# EAGLE board vldp-hw-rev03 (EAGLE 6.6.0)
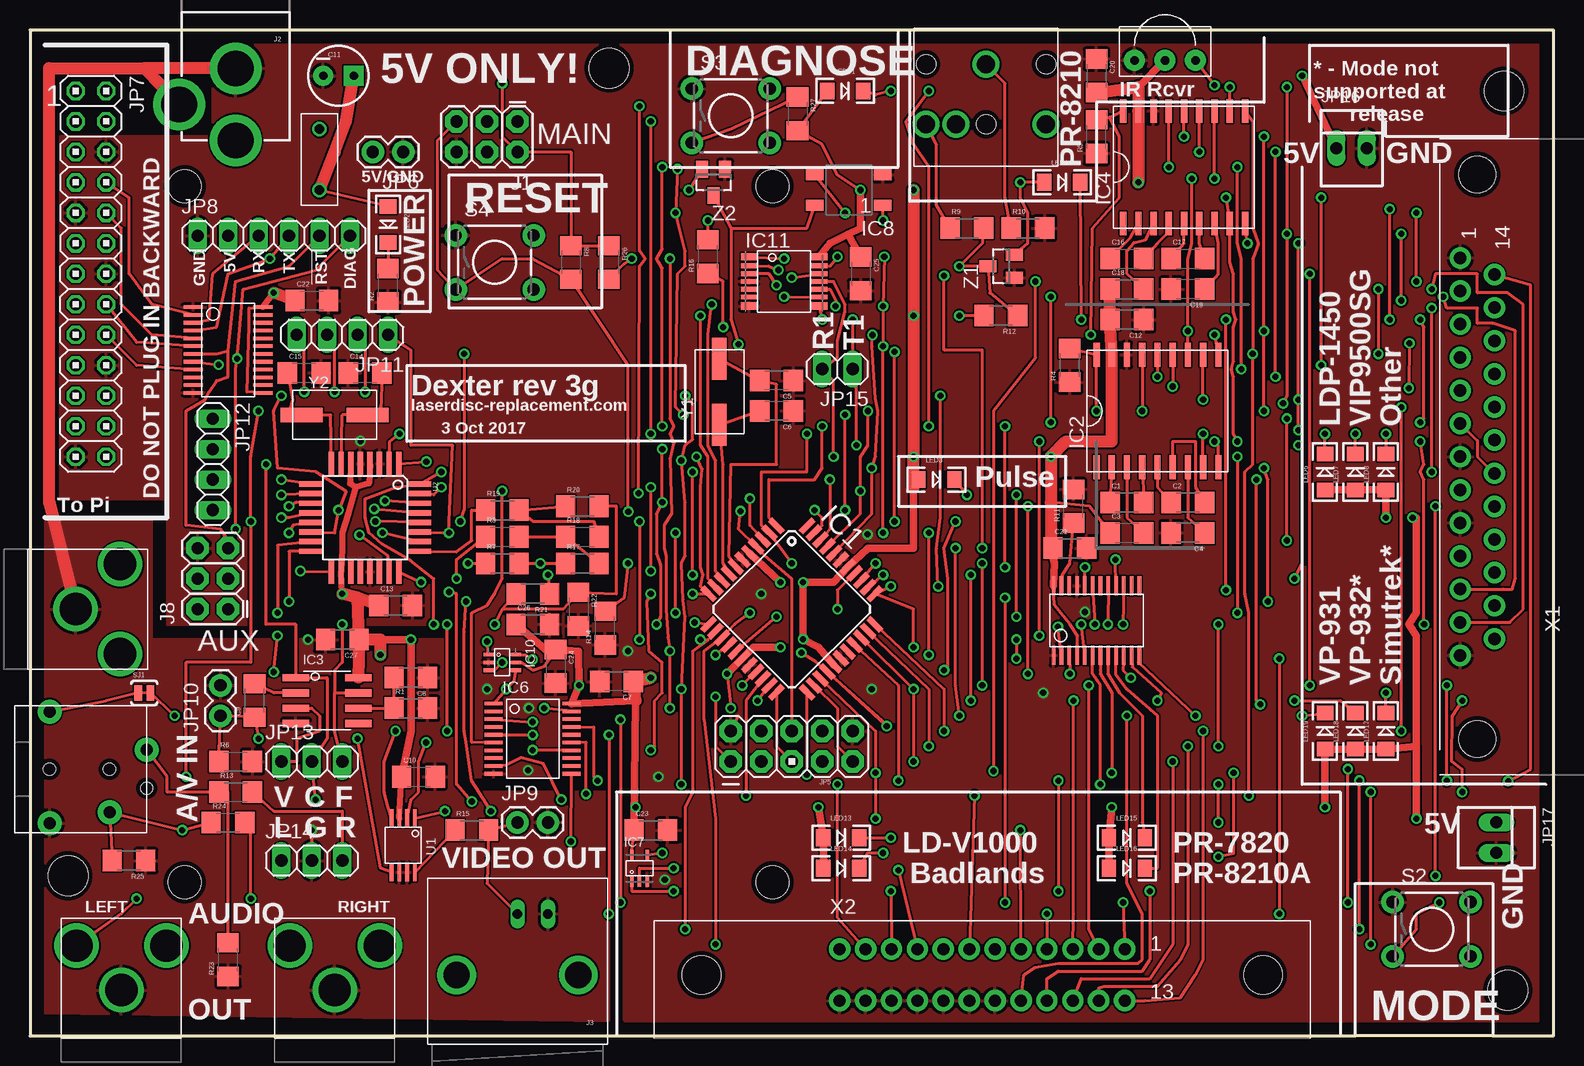
[diagram p3: board, top side]
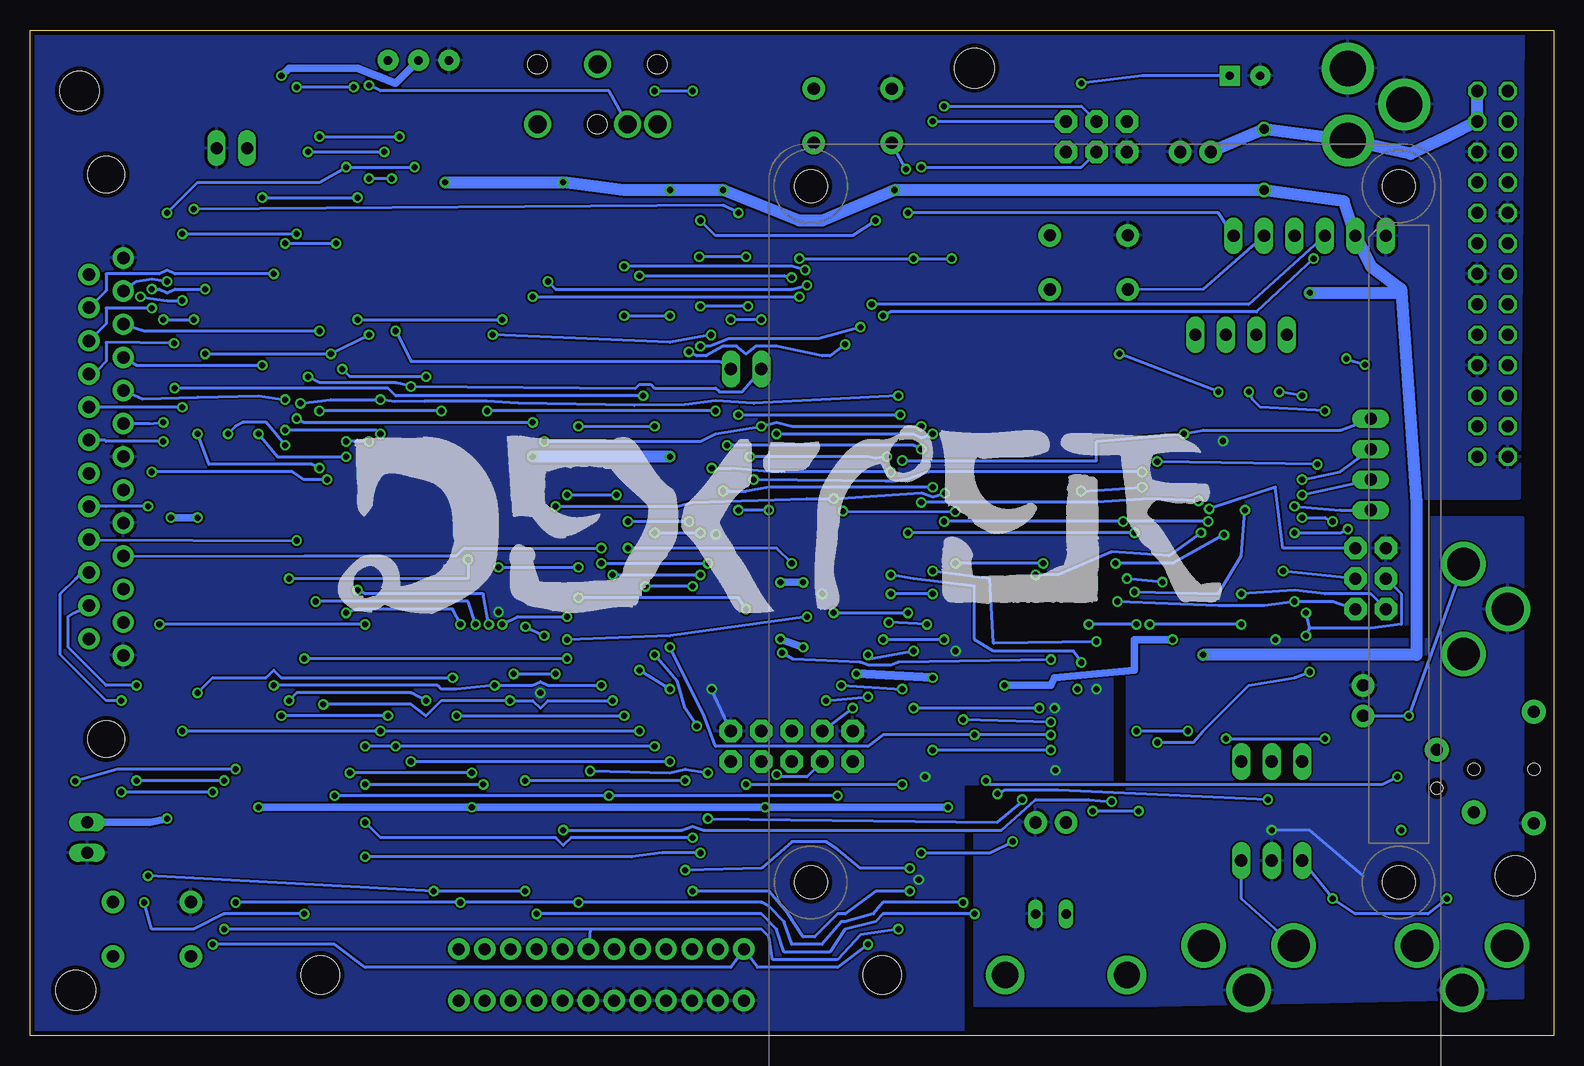
[diagram p4: board, bottom side, seen from below]

Size 127 x 83.82 mm. Coordinates in mm from the lower left corner, seen from the top.
Outline: 0,0 127,0 127,83.82 0,83.82 0,0
Copper layers (1*16): Top 0.0356mm / dielectric 1.5011mm / Bottom 0.0356mm
Design rules "OSHParkLaenPCBOrder": minimum track width 6mil, minimum drill 13mil, track to track 6mil, track to pad 6mil, pad to pad 6mil, via to via 6mil, smd to smd 6mil, copper to edge 15mil, drill to drill 6mil, minimum pad ring 7mil, minimum via ring 7mil, stop-mask expansion 3mil, vias tented up to drill 0mil, thermal gap 10mil

## Footprints (pad centres in the part's own frame; a part is rotated, then mirrored left to right if it is on the bottom)
RCA-SWITCHCRAFT-4X = drill 2.69: P1 0,0; P2 -3.75,3.7; P3 3.75,3.7
1206 = smd 1.6 x 1.8: 1 -1.4,0; 2 1.4,0
CPOL-RADIAL-10UF-25V = drill 0.7 pad 1.651 square: 1 1.27,0 | drill 0.7 pad 1.651: 2 -1.27,0
PTC = drill 0.8: P$1 -2.54,0; P$2 2.54,0
TQFP44 = smd 1.5 x 0.5: 1 -5.8,4; 2 -5.8,3.2; 3 -5.8,2.4; 4 -5.8,1.6; 5 -5.8,0.8; 6 -5.8,0; 7 -5.8,-0.8; 8 -5.8,-1.6; 9 -5.8,-2.4; 10 -5.8,-3.2; 11 -5.8,-4; 23 5.8,-4; 24 5.8,-3.2; 25 5.8,-2.4; 26 5.8,-1.6; 27 5.8,-0.8; 28 5.8,0; 29 5.8,0.8; 30 5.8,1.6; 31 5.8,2.4; 32 5.8,3.2; 33 5.8,4 | smd 0.5 x 1.5: 12 -4,-5.8; 13 -3.2,-5.8; 14 -2.4,-5.8; 15 -1.6,-5.8; 16 -0.8,-5.8; 17 0,-5.8; 18 0.8,-5.8; 19 1.6,-5.8; 20 2.4,-5.8; 21 3.2,-5.8; 22 4,-5.8; 34 4,5.8; 35 3.2,5.8; 36 2.4,5.8; 37 1.6,5.8; 38 0.8,5.8; 39 0,5.8; 40 -0.8,5.8; 41 -1.6,5.8; 42 -2.4,5.8; 43 -3.2,5.8; 44 -4,5.8
SO18 = smd 0.533 x 1.981: 1 -5.08,-4.686; 2 -3.81,-4.686; 3 -2.54,-4.686; 4 -1.27,-4.686; 5 0,-4.686; 6 1.27,-4.686; 7 2.54,-4.686; 8 3.81,-4.686; 9 5.08,-4.686; 10 5.08,4.686; 11 3.81,4.686; 12 2.54,4.686; 13 1.27,4.686; 14 0,4.686; 15 -1.27,4.686; 16 -2.54,4.686; 17 -3.81,4.686; 18 -5.08,4.686
LM1881M = smd 0.6 x 2.2: P1 -1.905,-2.6; P2 -0.635,-2.6; P3 0.635,-2.6; P4 1.905,-2.6; P5 1.905,2.6; P6 0.635,2.6; P7 -0.635,2.6; P8 -1.905,2.6
TSSOP24 = smd 0.3 x 1.6: 1 -3.575,-2.9; 2 -2.925,-2.9; 3 -2.275,-2.9; 4 -1.625,-2.9; 5 -0.975,-2.9; 6 -0.325,-2.9; 7 0.325,-2.9; 8 0.975,-2.9; 9 1.625,-2.9; 10 2.275,-2.9; 11 2.925,-2.9; 12 3.575,-2.9; 13 3.575,2.9; 14 2.925,2.9; 15 2.275,2.9; 16 1.625,2.9; 17 0.975,2.9; 18 0.325,2.9; 19 -0.325,2.9; 20 -0.975,2.9; 21 -1.625,2.9; 22 -2.275,2.9; 23 -2.925,2.9; 24 -3.575,2.9
TSSOP20-MPO = smd 0.3 x 1.5: 1 -2.925,-3.25; 2 -2.275,-3.25; 3 -1.625,-3.25; 4 -0.975,-3.25; 5 -0.325,-3.25; 6 0.325,-3.25; 7 0.975,-3.25; 8 1.625,-3.25; 9 2.275,-3.25; 10 2.925,-3.25; 11 2.925,3.25; 12 2.275,3.25; 13 1.625,3.25; 14 0.975,3.25; 15 0.325,3.25; 16 -0.325,3.25; 17 -0.975,3.25; 18 -1.625,3.25; 19 -2.275,3.25; 20 -2.925,3.25
TSSOP5 = smd 0.3 x 0.85: P$1 -0.65,-1.125; P$2 0,-1.125; P$3 0.65,-1.125; P$4 0.65,1.125; P$5 -0.65,1.125
CPC1008N = smd 0.889 x 1.448: 1 -1.27,-2.832; 2 1.27,-2.832; 3 1.27,2.832; 4 -1.27,2.832
TSSOP6-DCK = smd 0.3 x 0.85: P$1 -0.65,-1.125; P$2 0,-1.125; P$3 0.65,-1.125; P$4 0.65,1.125; P$5 0,1.125; P$6 -0.65,1.125
TSSOP14-MPO = smd 0.6 x 1.35: 1 -2.05,-2.925; 7 2.05,-2.925; 8 2.05,2.925; 14 -2.05,2.925 | smd 0.4 x 1.35: 2 -1.3,-2.925; 3 -0.65,-2.925; 4 0,-2.925; 5 0.65,-2.926; 6 1.3,-2.925; 9 1.3,2.925; 10 0.65,2.925; 11 0,2.925; 12 -0.65,2.925; 13 -1.3,2.925
VISHAY = drill 0.7 pad 1.75: 1 -2.54,0; 2 0,0; 3 2.54,0
2X3 = drill 1.016 pad 1.88 octagon: 1 0,0; 2 0,2.54; 3 2.54,0; 4 2.54,2.54; 5 5.08,0; 6 5.08,2.54
POWER_JACK_PTH = drill 2.997 pad 4.318: GND 0,7.7; GNDBREAK 4.7,10.7; PWR 0,13.7
BNC = drill 2.2: 3 -5.08,5.08; 4 5.08,5.08 | drill 0.8 long: GND -2.54,0; S 0,0
3.5MM-SJ-43514 = drill 1 pad 2: 1 2.9,4.8; 2 7.9,-3.6; 3 11,1.6; 4 2.9,-4.5 | hole 1: 7.9,0; 2.9,0; 11,-1.6
3.5MM-SJ1-3554NG = drill 1.5: 1 0,0; 2 5,-5; 3 5,5; 4 5,-2.5 | hole 1.6: 0,5; 0,-5; 5,0
STAND-OFF = hole 3.302: 0,0
AVR_ICSP = drill 1.016 pad 1.88 octagon: 1 -1.27,5.08; 2 1.27,5.08; 3 -1.27,2.54; 4 1.27,2.54; 5 -1.27,0; 6 1.27,0; 7 -1.27,-2.54; 8 1.27,-2.54; 9 -1.27,-5.08; 10 1.27,-5.08
1X02 = drill 1.016 pad 1.88: 1 0,0; 2 2.54,0
2X13 = drill 1.016 octagon: 1 -15.24,-1.27; 2 -15.24,1.27; 3 -12.7,-1.27; 4 -12.7,1.27; 5 -10.16,-1.27; 6 -10.16,1.27; 7 -7.62,-1.27; 8 -7.62,1.27; 9 -5.08,-1.27; 10 -5.08,1.27; 11 -2.54,-1.27; 12 -2.54,1.27; 13 0,-1.27; 14 0,1.27; 15 2.54,-1.27; 16 2.54,1.27; 17 5.08,-1.27; 18 5.08,1.27; 19 7.62,-1.27; 20 7.62,1.27; 21 10.16,-1.27; 22 10.16,1.27; 23 12.7,-1.27; 24 12.7,1.27; 25 15.24,-1.27; 26 15.24,1.27
1X06 = drill 1.016 long: 1 -6.35,0; 2 -3.81,0; 3 -1.27,0; 4 1.27,0; 5 3.81,0; 6 6.35,0
1X04 = drill 1.016 long: 1 -3.81,0; 2 -1.27,0; 3 1.27,0; 4 3.81,0
1X03 = drill 1.016 long: 1 -2.54,0; 2 0,0; 3 2.54,0
1X02' = drill 1.016 long: 1 -1.27,0; 2 1.27,0
22-23-2021 = drill 1 long: 1 -1.27,0; 2 1.27,0
LED-1206 = smd 1.2 x 1.4: A -1.5,0; C 1.5,0
TACTILE-PTH = drill 1.016 pad 1.88: 1 -3.251,2.261; 2 3.251,2.261; 3 -3.251,-2.261; 4 3.251,-2.261
SJ_2S-TRACE = smd 0.635 x 1.27: 1 -0.508,0; 2 0.508,0
MAXIM-UMAX-LONGPADS = smd 0.305 x 1.5: 1 -0.975,-2.25; 2 -0.325,-2.25; 3 0.325,-2.25; 4 0.975,-2.25; 5 0.975,2.25; 6 0.325,2.25; 7 -0.325,2.25; 8 -0.975,2.25
TQFP32-LONGPADS = smd 2 x 0.45: 1 -4.5,2.8; 2 -4.5,2; 3 -4.5,1.2; 4 -4.5,0.4; 5 -4.5,-0.4; 6 -4.5,-1.2; 7 -4.5,-2; 8 -4.5,-2.8; 17 4.5,-2.8; 18 4.5,-2; 19 4.5,-1.2; 20 4.5,-0.4; 21 4.5,0.4; 22 4.5,1.2; 23 4.5,2; 24 4.5,2.8 | smd 0.45 x 2: 9 -2.8,-4.5; 10 -2,-4.5; 11 -1.2,-4.5; 12 -0.4,-4.5; 13 0.4,-4.5; 14 1.2,-4.5; 15 2,-4.5; 16 2.8,-4.5; 25 2.8,4.5; 26 2,4.5; 27 1.2,4.5; 28 0.4,4.5; 29 -0.4,4.5; 30 -1.2,4.5; 31 -2,4.5; 32 -2.8,4.5
RPI2 = hole 2.75: 3.5,3.5; 61.5,3.5; 3.5,52.5; 61.5,52.5
A32077-ND = drill 1.041 pad 1.778: P1 -16.561,-1.422; P2 -13.801,-1.422; P3 -11.04,-1.422; P4 -8.28,-1.422; P5 -5.52,-1.422; P6 -2.76,-1.422; P7 0,-1.422; P8 2.76,-1.422; P9 5.52,-1.422; P10 8.28,-1.422; P11 11.04,-1.422; P12 13.801,-1.422; P13 16.561,-1.422; P14 -15.182,1.422; P15 -12.417,1.422; P16 -9.658,1.422; P17 -6.898,1.422; P18 -4.139,1.422; P19 -1.38,1.422; P20 1.38,1.422; P21 4.139,1.422; P22 6.898,1.422; P23 9.658,1.422; P24 12.417,1.422; P25 15.171,1.422 | hole 3.048: -23.52,0; 23.52,0
112-YYY-213R001 = drill 1 pad 1.778: 1 11.88,2.145; 2 9.72,2.145; 3 7.56,2.145; 4 5.4,2.145; 5 3.24,2.145; 6 1.08,2.145; 7 -1.08,2.145; 8 -3.24,2.145; 9 -5.4,2.145; 10 -7.56,2.145; 11 -9.72,2.145; 12 -11.88,2.145; 13 11.88,-2.145; 14 9.72,-2.145; 15 7.56,-2.145; 16 5.4,-2.145; 17 3.24,-2.145; 18 1.08,-2.145; 19 -1.08,-2.145; 20 -3.24,-2.145; 21 -5.4,-2.145; 22 -7.56,-2.145; 23 -9.72,-2.145; 24 -11.88,-2.145 | hole 3.2: 23.4,0; -23.4,0
CRYSTAL-CSM-3X = smd 3.5 x 1.2: P$1 -2.75,0; P$2 2.75,0
SOT23 = smd 1 x 1.4: 1 -0.95,-1.1; 2 0.95,-1.1; 3 0,1.1

## Placement (x,y rotation side)
AUD_LEFT  RCA-SWITCHCRAFT  [RCA-SWITCHCRAFT-4X]  7.62,3.81 0 top
AUD_RIGHT  RCA-SWITCHCRAFT  [RCA-SWITCHCRAFT-4X]  25.4,3.81 0 top
C1  0.1uF  [1206]  91.44,44.45 0 top
C2  0.1uF  [1206]  96.52,44.45 0 top
C3  0.1uF  [1206]  91.44,41.91 0 top
C4  0.1uF  [1206]  96.52,41.91 180 top
C5  20pF  [1206]  62.23,54.61 180 top
C6  20pF  [1206]  62.23,52.07 180 top
C7  0.1uF  [1206]  48.9,29.53 180 top
C8  0.1uF  [1206]  31.75,29.84 180 top
C9  0.1uF  [1206]  18.73,27.94 90 top
C10  0.1uF  [1206]  32.38,21.59 0 top
C11  470uF/10V  [CPOL-RADIAL-10UF-25V]  25.72,80.01 0 top
C12  0.1uF  [1206]  91.44,59.69 180 top
C13  0.1uF  [1206]  30.48,35.88 0 top
C14  20pF  [1206]  27.94,55.24 0 top
C15  20pF  [1206]  22.86,55.24 0 top
C16  0.1uF  [1206]  91.44,64.77 0 top
C17  0.1uF  [1206]  96.52,64.77 0 top
C18  0.1uF  [1206]  91.44,62.23 0 top
C19  0.1uF  [1206]  96.52,62.23 180 top
C20  0.1uF  [1206]  88.9,80.01 270 top
C21  0.1uF  [1206]  86.68,40.64 0 top
C22  0.1uF  [1206]  23.5,61.28 0 top
C23  0.1uF  [1206]  51.75,17.14 0 top
C24  0.1uF  [1206]  43.81,30.8 270 top
C25  0.1uF  [1206]  69.25,63.5 270 top
C26  0.1uF  [1206]  41.91,34.29 0 top
C27  0.1uF  [1206]  26.04,33.02 180 top
F1  250mA PTC  [PTC]  24.13,73.03 270 top
IC1  ATMEGA644-MPO  [TQFP44]  63.5,35.56 315 top
IC2  MAX222CWN  [SO18]  93.98,52.07 0 top
IC3  LM1881-MPO  [LM1881M]  24.77,27.94 270 top
IC4  MAX222CWN  [SO18]  96.2,72.39 0 top
IC5  STP16CP05  [TSSOP24]  88.9,34.61 0 top
IC6  SN74LS244  [TSSOP20-MPO]  41.91,24.77 270 top
IC7  PR8210A_RMT  [TSSOP5]  50.8,13.97 0 top
IC8  CPC1008N  [CPC1008N]  68.26,70.48 90 top
IC9  SN74CBTD3384  [TSSOP24]  16.51,57.15 270 top
IC10  OR_GATE_3INPUT  [TSSOP6-DCK]  39.37,31.11 270 top
IC11  74HCT126  [TSSOP14-MPO]  62.87,62.87 270 top
IR1  TSOP2438  [VISHAY]  94.61,81.28 180 top
J1  AVR_SPI_PRG_6PTH  [2X3]  40.64,76.2 180 top
J2  IN-5V  [POWER_JACK_PTH]  17.14,88.31 180 top
J3  BNCPTH  [BNC]  40.64,10.16 180 top
J4  AV  [3.5MM-SJ-43514]  -1.27,22.23 0 top
J5  PR8210  [3.5MM-SJ1-3554NG]  79.69,80.96 270 top
J8  AVR_SPI_PRG_6PTH  [2X3]  16.51,35.56 90 top
JP1  STAND-OFF  [STAND-OFF]  123.19,3.81 0 bottom
JP2  STAND-OFF  [STAND-OFF]  3.17,13.34 0 top
JP3  STAND-OFF  [STAND-OFF]  122.87,78.74 0 top
JP4  STAND-OFF  [STAND-OFF]  48.26,80.64 0 top
JP5  JTAG  [AVR_ICSP]  63.5,24.13 90 top
JP6  [1X02]  31.11,73.66 180 top
JP7  RPI_IO  [2X13]  5.08,63.5 270 top
JP8  [1X06]  20.32,66.67 0 top
JP9  [1X02]  40.64,17.78 0 top
JP10  [1X02]  15.88,26.67 90 top
JP11  [1X04]  26.04,58.42 180 top
JP12  [1X04]  15.24,47.62 270 top
JP13  [1X03]  23.5,22.86 0 top
JP14  [1X03]  23.5,14.61 0 top
JP15  [1X02']  67.31,55.56 180 top
JP16  22-23-2021  [22-23-2021]  110.17,73.98 0 top
JP17  22-23-2021  [22-23-2021]  122.24,16.51 270 top
LED2  [LED-1206]  29.84,67.63 270 top
LED3  [LED-1206]  75.56,46.35 0 top
LED6  [LED-1206]  107.95,46.99 90 top
LED7  [LED-1206]  110.49,46.99 90 top
LED8  [LED-1206]  113.03,46.99 90 top
LED10  [LED-1206]  86.04,71.12 0 top
LED11  [LED-1206]  67.94,78.74 0 top
LED13  [LED-1206]  67.63,16.51 0 top
LED14  [LED-1206]  67.63,13.97 0 top
LED15  [LED-1206]  91.44,16.51 0 top
LED16  [LED-1206]  91.44,13.97 0 top
LED17  [LED-1206]  113.03,25.4 90 top
LED18  [LED-1206]  110.49,25.4 90 top
LED19  [LED-1206]  107.95,25.4 90 top
R1  680k  [1206]  31.75,27.3 0 top
R2  330  [1206]  29.84,62.55 90 top
R3  1500  [1206]  39.37,41.59 0 top
R4  1k  [1206]  86.68,55.88 90 top
R5  1k  [1206]  88.9,74.93 90 top
R6  75  [1206]  17.14,22.86 0 top
R7  1500  [1206]  39.37,39.37 0 top
R8  4.7k  [1206]  45.09,64.45 270 top
R9  75  [1206]  78.11,67.31 0 top
R10  1k  [1206]  83.19,67.31 0 top
R11  1k  [1206]  87,44.13 90 top
R12  4.7k  [1206]  80.92,60.02 180 top
R13  1k  [1206]  17.14,20.32 0 top
R14  1500  [1206]  47.94,33.97 90 top
R15  75  [1206]  36.83,17.14 0 top
R16  1k  [1206]  56.52,64.93 90 top
R17  750  [1206]  46.04,39.37 0 top
R18  750  [1206]  46.04,41.59 0 top
R19  1500  [1206]  39.37,43.81 0 top
R20  750  [1206]  46.04,44.13 0 top
R21  1500  [1206]  41.91,36.83 180 top
R22  330  [1206]  45.72,35.56 270 top
R23  680k  [1206]  16.51,6.35 90 top
R24  1k  [1206]  16.51,17.78 0 top
R25  680k  [1206]  8.26,14.61 180 top
R26  4.7k  [1206]  48.26,64.45 270 top
R27  4.7k  [1206]  63.98,76.83 270 top
S2  MODE  [TACTILE-PTH]  116.84,8.89 0 top
S3  DIAGNOSE  [TACTILE-PTH]  58.42,76.68 0 top
S4  RESET  [TACTILE-PTH]  38.73,64.45 0 top
SJ1  SOLDERJUMPERTRACE  [SJ_2S-TRACE]  9.53,28.57 0 top
U1  MAX4313  [MAXIM-UMAX-LONGPADS]  31.11,15.88 180 top
U2  ATMEGA328P  [TQFP32-LONGPADS]  27.94,43.18 270 top
U$1  RASPBERRY_PI2_LAYOUT  [RPI2]  65.41,74.3 270 bottom
U$2  [DEXTER_LOGO]  102.87,34.29 0 bottom
VID_IN  RCA-SWITCHCRAFT  [RCA-SWITCHCRAFT-4X]  3.81,35.56 270 top
X1  DB25-ALL  [A32077-ND]  120.65,48.26 270 top
X2  LD-V1000/PR-7820/PR-8210A  [112-YYY-213R001]  79.38,5.08 0 top
Y1  18.432MHz  [CRYSTAL-CSM-3X]  57.47,53.66 90 top
Y2  16 MHz  [CRYSTAL-CSM-3X]  25.4,51.75 0 top
Z1  BAT54S  [SOT23]  80.96,64.14 90 top
Z2  BAT54S  [SOT23]  56.99,71.12 180 top

## Tracks (layer width: path | path; a pad name or v marks a point on that pad's centre or on a via)
5V
  Bottom 1.016: JP6.2 F1.P$1 J2.PWR 11.91,73.5 8.89,74.93 JP7.4 JP7.2
!AUX_MOSI_SHDN  (via drill 0.51)
  Top 0.254: U1.2 31.75,19.68 32.38,20.32 32.38,22.86 v33.02,24.45 | 23.44,41.27 U2.15 20.64,40.86 v20.64,35.24 | v20.32,30.32 v20.64,33.34
  Bottom 0.254: J8.4 12.7,36.83 12.7,34.29 15.24,33.97 20.32,33.97 | 20.32,33.97 v20.64,35.24 | v33.02,24.45 30,24.45 29.21,25.4 25.4,29.21 21.59,29.84 v20.32,30.32 | v20.64,33.34 20.32,33.97
!AUX_VSYNC  (via drill 0.51)
  Top 0.254: U2.12 21.59,43.18 v20.95,43.18 | v19.05,52.07 18.41,48.26 v18.41,42.86 18.41,31.11 13.02,31.11 v13.02,21.59 | v25.4,53.66 25.4,57.15 JP11.3 | IC6.17 46.99,25.72 46.99,21.59 v47.31,21.27
  Bottom 0.254: v20.95,43.18 19.05,43.18 v18.41,42.86 | v19.05,52.07 24.45,52.39 25.08,53.02 v25.4,53.66 | v47.31,21.27 46.99,20.95 14.29,20.95 v13.02,21.59
!ENABLE_TX  (via drill 0.51)
  Top 0.254: IC10.P$4 40.32,29.53 v39.69,28.89 IC6.1
!PR8210_IR  (via drill 0.51)
  Top 0.254: v98.74,79.22 IR1.1
  Bottom 0.254: J5.4 78.74,78.74 97.79,78.74 v98.74,79.22
!PR8210_R_CTRL  (via drill 0.51)
  Top 0.254: IC11.2 61.59,64.14 v62.39,63.82 | R9.2 79.38,67.31 79.38,66.04 v77.47,64.14 Z1.3 80.01,61.91 R12.1
  Bottom 0.254: v62.39,63.82 63.5,64.14 v77.47,64.14
!PR8210A_CMB  (via drill 0.51)
  Top 0.254: IC7.P$4 v52.7,15.24 | v45.09,16.19 IC6.11
  Bottom 0.254: v52.7,15.24 46.99,15.24 v45.09,16.19
!PR8210A_ENABLE  (via drill 0.51)
  Top 0.254: IC6.19 v42.86,27.3 | v53.34,27.3 v53.34,32.07 53.18,33.18 53.02,35.56 53.02,40.01 52.86,40.64 52.86,42.55 53.5,43.5 53.34,48.1 53.66,49.37 53.34,50.16 53.66,50.8 53.34,51.44 v53.34,64.77 | v57.15,31.75 IC1.15 | IC11.1 v62.87,64.77 | v50.16,64.77 49.53,64.32 R26.2
  Bottom 0.254: v42.86,27.3 v53.34,27.3 | v53.34,32.07 56.83,31.43 v57.15,31.75 | v62.87,64.77 v53.34,64.77 v50.16,64.77
!PR8210A_R_CTRL  (via drill 0.51)
  Top 0.254: IC7.P$1 50.16,12.06 v53.66,12.06 | v71.75,12.06 X2.10
  Bottom 0.254: v53.66,12.06 56.52,12.06 59.05,10.16 59.69,10.16 61.59,8.26 62.55,8.26 63.82,10.16 65.41,12.06 v71.75,12.06
!RDEN  (via drill 0.51)
  Top 0.254: v79.38,40.64 79.38,57.15 76.2,57.15 v76.2,63.34 | v63.5,63.18 IC11.12
  Bottom 0.254: X1.P10 104.14,40.01 91.44,40.01 90.81,40.64 v79.38,40.64 | v76.2,63.34 64.14,63.34 v63.5,63.18
!REMOTE_CTRL  (via drill 0.51)
  Top 0.254: IC1.25 70.48,25.4 v70.48,21.91 v70.48,18.1 | v80.32,22.07 80.33,52.07 83.82,56.52 v83.82,62.87 | v44.29,19.68 42.8,22.67 40.96,23.18 39.69,22.54 IC6.9 | v62.23,62.55 61.59,63.5 IC11.3
  Bottom 0.254: v70.48,18.1 46.35,17.78 44.45,19.37 v44.29,19.68 | v80.32,22.07 73.66,21.91 72.39,22.23 v70.48,21.91 | v83.82,62.87 83.19,62.23 63.5,62.23 v62.23,62.55
!RST  (via drill 0.51)
  Top 0.254: R8.2 45.22,63.18 | v28.7,43.91 U2.29 | IC9.7 15.56,56.83 16.51,57.07 | 16.51,57.07 17.14,62.87 21.59,64.14 JP8.5 | J8.5 16.51,41.27 15.88,42.23 13.02,42.55 13.02,52.07 14.61,53.02 14.92,53.66 15.56,54.61 16.51,54.93 16.51,57.07 | J1.5 33.97,74.61 33.97,63.82 S4.3 39.37,64.77 41.91,64.77 R8.2 | JP5.6 63.5,38.1 61.28,40.01 IC1.4 59.05,42.23 v59.23,43.73 | v49.87,43.69 49.85,55.88 R8.2
  Bottom 0.254: J8.5 22.54,40.64 23.18,45.72 v28.7,43.91 | JP8.5 29.21,62.23 S4.3 | v59.23,43.73 v49.87,43.69
!RST3V3
  Top 0.254: IC9.6 8.89,57.78 JP7.16
!WREN  (via drill 0.51)
  Top 0.254: v104.78,41.27 v104.78,51.44 | v85.09,51.12 v85.09,61.59 | v62.87,61.59 IC11.9
  Bottom 0.254: X1.P22 v104.78,41.27 | v104.78,51.44 104.14,51.12 v85.09,51.12 | v85.09,61.59 v62.87,61.59
AUDIO_LEFT  (via drill 0.51)
  Top 0.254: AUD_LEFT.P2 7.62,10.16 v8.89,11.43 | v18.41,11.43 18.41,17.78 R24.2
  Bottom 0.254: v8.89,11.43 10.48,10.16 16.51,10.16 v18.41,11.43 JP14.1
AUDIO_RIGHT
  Top 0.254: R13.2 20.32,18.73 26.04,18.73 JP14.3
  Bottom 0.254: AUD_RIGHT.P2 26.04,11.43 JP14.3
AUX_D0  (via drill 0.51)
  Top 0.254: U2.23 29.84,40.01 v27.46,41.75 | v36.51,39.37 R7.1
  Bottom 0.254: v27.46,41.75 31.75,39.37 v36.51,39.37
AUX_D1  (via drill 0.51)
  Top 0.254: U2.24 v32.6,37.81 | v35.56,38.1 35.56,39.69 R3.1
  Bottom 0.254: v32.6,37.81 v35.56,38.1
AUX_D2
  Top 0.254: U2.25 35.56,40.32 36.83,41.27 36.83,43.81 R19.1
AUX_D3  (via drill 0.51)
  Top 0.254: U2.26 v29.38,41.92 | v43.18,38.42 R21.1
  Bottom 0.254: v29.38,41.92 32.07,40.01 36.83,40.32 41.27,38.42 v43.18,38.42
AUX_MISO_A0  (via drill 0.51)
  Top 0.254: v38.42,18.73 36.83,21.27 36.35,24.45 36.2,25.4 36.2,33.66 v36.35,36.2 | U2.16 21.59,40.38 v21.59,36.2 | U1.1 v34.59,18.73
  Bottom 0.254: v36.35,36.2 27.94,35.88 24.13,35.88 v21.59,36.2 18.41,36.2 J8.1 | v34.59,18.73 v38.42,18.73
AUX_PD5  (via drill 0.51)
  Top 0.254: U2.9 v20.95,46.35
  Bottom 0.254: v20.95,46.35 17.78,46.99 JP12.2
AUX_PD6  (via drill 0.51)
  Top 0.254: U2.10 v20.95,45.09
  Bottom 0.254: v20.95,45.09 JP12.3
AUX_PD7  (via drill 0.51)
  Top 0.254: U2.11 22.23,44.45 v21.59,44.13
  Bottom 0.254: v21.59,44.13 17.78,43.81 JP12.4
AUX_SCK  (via drill 0.51)
  Top 0.254: v22.54,38.73 U2.17
  Bottom 0.254: J8.3 v22.54,38.73
AUX_TX  (via drill 0.51)
  Top 0.254: IC6.6 36.83,24.45 36.83,35.24 38.1,35.88 38.73,36.83 39.37,38.1 v39.37,45.4 | v34.29,45.72 33.66,45.09 U2.31
  Bottom 0.254: v39.37,45.4 v34.29,45.72
CNT1_DB14  (via drill 0.51)
  Top 0.254: IC6.3 v41.91,26.15 | v49.21,26.35 v49.21,11.11 | v91.12,11.11 X2.1 | IC1.37 67.31,37.15 v67.31,35.56 | v81.28,36.51 v81.28,11.11 | v109.86,11.11 v109.86,22.23 | v123.22,21.23 125.09,22.23 125.09,62.55 X1.P14
  Bottom 0.254: v41.91,26.15 v49.21,26.35 | v49.21,11.11 55.88,11.11 56.67,10.16 59.05,9.53 59.37,9.53 60.96,7.62 63.5,7.62 64.14,9.53 65.41,10.79 66.04,11.11 v81.28,11.11 v91.12,11.11 v109.86,11.11 | v67.31,35.56 67.94,36.51 v81.28,36.51 | v109.86,22.23 119.7,22.23 v123.22,21.23
CNT2_DB15  (via drill 0.51)
  Top 0.254: X2.2 88.27,8.89 v88.27,29.21 | v79.38,29.21 v79.38,39.37 | v70.48,39.37 IC1.36 | v106.68,29.21 v106.68,63.5
  Bottom 0.254: X1.P15 120.65,62.1 120.65,63.5 116.2,63.5 115.57,63.82 114.94,63.5 v106.68,63.5 | v79.38,29.21 83.82,29.21 84.45,29.53 85.09,29.21 v88.27,29.21 91.44,28.89 92.71,28.89 93.03,29.21 v106.68,29.21 | v79.38,39.37 v70.48,39.37
CNT3_DB16  (via drill 0.51)
  Top 0.254: X2.3 87,10.16 v87,27.94 | v78.42,27.94 v78.42,38.42 | v71.12,38.42 IC1.35 | v102.55,27.62 102.23,27.94 v102.23,46.35 | v116.84,46.99 v116.84,60.64
  Bottom 0.254: v116.84,60.64 120.65,60.64 120.65,59.34 X1.P16 | v78.42,27.94 83.82,27.94 84.45,27.3 85.09,27.94 v87,27.94 92.71,27.94 93.98,26.67 95.25,27.62 v102.55,27.62 | v78.42,38.42 v71.12,38.42 | v102.23,46.35 104.14,46.35 105.09,46.99 v116.84,46.99
CNT4_DB17  (via drill 0.51)
  Top 0.254: 84.78,7.3 X2.4 v84.77,10.16 | IC6.5 v41.91,25.08 | v48.26,25.08 v48.26,10.16 | v73.66,32.38 73.66,35.56 IC1.34 v71.75,37.47 | v75.71,37.46 75.56,40.63 75.88,43.18 v75.88,53.34 | v114.99,57.72 v114.94,53.98
  Bottom 0.254: X1.P17 121.37,55.48 120.65,56.2 120.65,57.78 v114.99,57.72 | v41.91,25.08 v48.26,25.08 55.88,25.08 57.15,24.13 69.85,24.13 70.8,26.67 v73.66,32.38 | v48.26,10.16 55.88,10.16 56.52,9.53 59.05,8.89 60.33,6.99 64.14,6.99 64.77,8.89 66.04,10.16 v84.77,10.16 | v71.75,37.47 v75.71,37.46 | v75.88,53.34 96.52,53.34 97.16,53.98 v114.94,53.98
CNT6_DB24  (via drill 0.51)
  Top 0.254: U2.28 v28.79,42.86 | JP11.2 27.94,57.15 v27.94,53.66 | v36.2,56.83 36.2,43.81 v35.88,42.86 | v50.8,42.86 v50.8,33.02 | v55.88,33.02 56.52,33.02 | 56.52,33.02 IC1.13 | 56.52,33.02 55.24,32.07 55.24,20.32 54.61,19.05 v54.61,8.89 | v110.81,8.89 v110.81,21.27 | v118.11,21.27 v118.11,29.21
  Bottom 0.254: X1.P24 123.31,35.24 123.83,34.92 123.83,32.38 120.65,29.21 v118.11,29.21 | v28.79,42.86 v35.88,42.86 v50.8,42.86 | v27.94,53.66 v36.2,56.83 | v50.8,33.02 v55.88,33.02 | v54.61,8.89 57.78,8.41 59.69,6.35 65.09,6.35 65.41,8.26 66.04,8.89 80.33,8.89 | 80.33,8.89 X2.6 | 80.33,8.89 v110.81,8.89 | v110.81,21.27 v118.11,21.27
CNT7_DB12  (via drill 0.51)
  Top 0.254: X1.P12 123.36,34.46 124.46,35.56 124.46,60.96 123.19,61.91 120.65,61.91 120.65,63.5 117.16,63.5 v116.84,62.23 | IC1.20 59.69,27.94 v59.69,20 | v78.74,20 X2.7 | v101.6,20 101.6,35.24 101.28,36.83 101.28,46.99 101.92,47.62 v101.92,56.83 101.92,64.77 102.38,66.02 101.92,67.31 101.92,76.2 IC4.10 | v98.74,58.42 IC2.10 | v112.39,62.23 v112.39,56.83
  Bottom 0.254: v59.69,20 v78.74,20 v101.6,20 | v98.74,58.42 v101.92,56.83 v112.39,56.83 | v116.84,62.23 116.2,62.23 115.57,61.91 114.94,62.23 v112.39,62.23
CNT11_DB11  (via drill 0.51)
  Top 0.254: 122.8,37.22 X1.P11 123.58,37.22 123.83,38.1 123.83,58.74 121.92,59.37 120.65,59.37 120.65,60.64 118.11,60.64 v117.79,61.59 | U2.2 29.96,49.5 v30.8,50.16 | IC1.19 v59.37,29.21 | X2.11 67.31,9.84 v67.31,20.95 | v54.29,20.95 v54.29,28.89 54.61,34.92 54.45,36.35 54.29,39.37 54.61,40.01 54.61,44.45 v54.29,47.94 54.61,49.21 55.24,49.69 55.24,52.7 v54.61,53.34 | v97.79,53.02 IC2.11 | IC4.11 v100.01,79.06 | v104.78,79.06 v104.78,66.83 104.78,53.34 v104.46,52.7 | v114.3,61.28 v114.3,66.83
  Bottom 0.254: JP12.1 17.78,50.48 29.21,50.48 v30.8,50.16 38.1,49.53 38.1,47.94 v54.29,47.94 | v59.37,29.21 v54.29,28.89 | v67.31,20.95 v54.29,20.95 | v54.61,53.34 66.67,52.7 69.84,52.93 72.41,52.61 76.61,52.54 86.31,52.72 88.93,52.89 94.13,52.87 96.57,52.86 v97.79,53.02 101.92,53.02 v104.46,52.7 | v100.01,79.06 v104.78,79.06 | v117.79,61.59 115.57,61.28 v114.3,61.28 | v114.3,66.83 v104.78,66.83
CNT12_DB23  (via drill 0.51)
  Top 0.254: U2.27 v34.92,41.91 34.92,42.86 35.24,49.21 31.75,49.21 31.75,57.15 JP11.1 | v60.01,35.24 58.74,34.29 IC1.14 56.2,32.07 56.2,26.35 57.15,18.1 v57.15,7.62 | v53.82,35.24 v53.82,41.91 | v111.76,7.62 v111.76,20.32 | v119.38,20.32 119.38,22.23 118.52,22.88 118.55,26.64 v119.38,27.94
  Bottom 0.254: X1.P23 122.89,38.42 123.19,38.1 124.46,36.83 124.46,31.75 120.65,27.94 v119.38,27.94 | v34.92,41.91 v53.82,41.91 | v60.01,35.24 v53.82,35.24 | v57.15,7.62 59.69,5.71 66.36,5.71 X2.12 68.58,5.71 99.06,5.71 101.6,7.62 v111.76,7.62 | v111.76,20.32 v119.38,20.32
CNT13_DB18  (via drill 0.51)
  Top 0.254: X2.13 92.95,2.94 95.89,3.17 97.16,5.08 97.79,6.35 v97.79,25.4 | IC1.33 76.2,28.89 v76.2,25.4 | v114.3,25.4 v114.3,52.39
  Bottom 0.254: v114.3,52.39 122.06,52.39 X1.P18 | v76.2,25.4 v97.79,25.4 v114.3,25.4
CNT14_DB19  (via drill 0.51)
  Top 0.254: X2.14 89.09,4 89.53,4.13 93.98,4.13 95.89,6.35 96.52,7.62 v96.52,24.13 | IC1.32 74.93,28.89 v74.93,24.13 | v99.06,24.13 v99.06,34.29 | v116.2,34.29 116.2,46.35 115.89,46.99 116.2,47.62 v115.89,49.53
  Bottom 0.254: X1.P19 120.76,49.64 120.65,49.53 v115.89,49.53 | v74.93,24.13 v96.52,24.13 v99.06,24.13 | v99.06,34.29 v116.2,34.29
CNT15_TIED  (via drill 0.51)
  Top 0.254: X2.15 87.63,4.76 93.34,4.76 95.25,7.62 v95.25,22.86 | v73.66,22.86 v73.66,28.89 IC1.31 | 58.42,67.31 58.42,59.69 v59.05,57.63 | v76.2,30.48 76.52,30.8 76.52,38.1 76.2,40.64 v77.15,42.86 | v72.07,42.86 v72.07,56.99 | Z2.3 58.42,67.31 | 58.42,67.31 64.77,67.31 IC8.4
  Bottom 0.254: v73.66,22.86 v95.25,22.86 | v59.05,57.63 60.33,56.67 60.96,56.67 64.77,57.47 66.52,57.47 67.31,56.83 68.1,57.47 69.22,57.47 70.64,56.67 71.44,56.67 v72.07,56.99 | v73.66,28.89 v76.2,30.48 | v77.15,42.86 v72.07,42.86
CNT16_DB21  (via drill 0.51)
  Top 0.254: X2.16 84.78,4.76 85.72,5.4 92.71,5.4 93.34,6.35 v93.34,12.06 | IC1.30 72.39,29.21 v72.39,21.27 | v85.72,21.27 v85.72,12.06 | v117.16,13.34 v117.16,44.13
  Bottom 0.254: X1.P21 120.66,44.12 120.65,44.13 v117.16,44.13 | v72.39,21.27 v85.72,21.27 | v85.72,12.06 v93.34,12.06 v117.16,13.34
CNT17_MISO  (via drill 0.51)
  Top 0.254: X2.17 82.87,5.08 83.82,5.71 85.72,6.03 92.39,6.03 92.71,6.35 92.71,10.16 91.44,12.7 v91.44,26.67 | v63.5,39.37 IC1.2 60.96,42.55 60.96,46.99 64.77,46.99 v64.77,50.16 | v77.47,26.67 77.15,29.21 v77.15,40.64 | v51.75,50.16 v51.75,76.2
  Bottom 0.254: v63.5,39.37 64.77,40.64 v77.15,40.64 | v91.44,26.67 v77.47,26.67 | v64.77,50.16 53.34,50.16 52.7,49.85 v51.75,50.16 | v51.75,76.2 J1.1
CSYNC  (via drill 0.51)
  Top 0.254: v23.81,19.68 JP13.2 24.77,24.77 24.77,29.84 IC3.P1 22.16,34.29 19.68,34.29 v19.68,47.62 | v46.35,20.16 46.35,24.45 IC6.15 | U2.1 v33.04,47.85
  Bottom 0.254: v23.81,19.68 41.27,20.48 45.72,20.48 v46.35,20.16 | v19.68,47.62 v33.04,47.85
DCE  (via drill 0.51)
  Top 0.254: v51.75,38.73 v51.75,45.72 | IC1.41 69.22,43.5 v69.22,45.4 69.22,48.26 69.85,49.21 v69.85,52.07 | R4.2 IC2.18 v88.9,52.07 | IC10.P$1 v38.1,32.86
  Bottom 0.254: v38.1,32.86 46.67,32.7 46.99,38.1 v51.75,38.73 | v51.75,45.72 65.41,45.72 67.31,45.4 v69.22,45.4 | v69.85,52.07 v88.9,52.07
DIAG  (via drill 0.51)
  Top 0.254: JP8.6 23.81,63.82 17.78,62.23 v17.27,56.44 17.14,55.56 v17.14,42.23 | U2.13 21.91,42.55 v21.59,41.91 | IC9.8 v15.73,55.93 | IC1.43 66.04,42.55 66.04,43.18 v65.41,43.81 | v67.94,43.81 v67.94,51.75 | v54.45,51.75 53.82,52.39 53.98,63.5 54.61,64.14 54.61,65.41 v53.82,68.58 v53.98,72.23 | R27.1 58.42,75.56 S3.3
  Bottom 0.254: v21.59,41.91 17.78,41.91 v17.14,42.23 | v17.27,56.44 v15.73,55.93 | JP8.6 27.94,68.58 v53.82,68.58 | v65.41,43.81 v67.94,43.81 | v67.94,51.75 v54.45,51.75 | v53.98,72.23 S3.3
DIAG3V3
  Top 0.254: IC9.9 8.89,55.88 JP7.18
DTE  (via drill 0.51)
  Top 0.254: v55.24,38.42 v55.24,46.99 | IC1.40 70.17,43.5 v70.17,47.31 70.48,48.26 70.68,52.05 70.47,53.1 70.21,57.46 v70.22,58.4 | R5.2 90,76.55 | 90,76.55 IC4.18 | v88.42,58.42 88.58,67.31 90.81,69.85 90.81,74.93 90,76.55 | IC10.P$3 38.73,30.48 v39.37,31.11
  Bottom 0.254: v39.37,31.11 40.01,32.07 46.67,32.07 48.26,33.02 48.26,37.47 53.34,38.1 v55.24,38.42 | v55.24,46.99 65.41,46.99 68.58,47.31 v70.17,47.31 | v70.22,58.4 73.66,57.78 v88.42,58.42
FIELD  (via drill 0.51)
  Top 0.254: JP13.3 25.4,25.4 25.4,28.57 | 25.4,28.57 IC3.P7 | v26.04,34.29 26.04,31.11 25.4,30.48 25.4,28.57 | v33.66,34.29 33.66,38.1 31.7,39.65 29.34,40.97 28.26,41.91 27.94,43.18 27.94,44.77 30.48,45.72 U2.32 v34.29,46.99 | v66.67,46.35 66.67,42.23 IC1.42
  Bottom 0.254: v26.04,34.29 v33.66,34.29 | v34.29,46.99 52.07,46.99 53.98,46.35 54.84,46.22 55.7,46.22 v66.67,46.35
GND  (via drill 0.51)
  Top 0.254: JP5.2 59.05,26.67 | v23.5,17.14 JP14.2
  Top 1.016: 9.53,80.64 1.59,80.64 1.59,44.45 VID_IN.P1 | 9.53,80.64 J2.GNDBREAK | 16.83,80.64 9.53,80.64
  Bottom 0.254: JP5.10 v70.17,28.89 | 15.88,13.34 20.32,17.14 v23.5,17.14
  other vias: 27.55,49.57 23.18,33.02 41.52,22.14 38.1,28.89 49.85,32.07 52.39,21.59 84.45,28.57 87.94,35.32 69.82,41.79 60.96,36.83 41.59,27.3 52.92,13.01
  pour Top: 1.27,43.18 1.27,1.91 48.26,1.27 48.26,20.32 35.56,20.32 35.56,33.02 10.16,33.02 10.16,43.18
  pour Bottom: 2.54,43.18 10.16,43.18 10.16,33.02 35.56,33.02 35.56,20.32 48.26,20.32 48.26,2.54 33.02,2.54 2.54,3.17
  pour Top: 2.54,74.93 2.54,44.77 11.43,44.77 11.43,34.29 36.83,34.29 36.83,21.59 49.53,21.59 49.53,1.27 125.73,1.27 125.73,82.55 15.24,82.55 15.24,74.93
  pour Bottom: 2.54,83.82 2.86,44.77 11.43,44.77 11.43,34.29 36.83,34.29 36.83,20.95 49.21,20.95 49.21,0 127,0 127,83.82
INT0RX1  (via drill 0.51)
  Top 0.254: IC6.14 v41.91,23.81 | v51.75,23.81 52.07,24.13 52.07,27.94 52.7,28.57 52.7,31.11 51.59,32.07 51.44,36.2 v51.75,36.83 | v55.24,36.83 IC1.11 55.88,37.47 56.11,38.45 55.88,39.05 55.88,45.72 56.04,47.23 v55.56,48.26 | v66.99,48.26 66.99,54.61 JP15.2 67.31,56.52 67.31,57.94 67.94,60.33 67.94,60.96 66.99,62.87 IC11.11 | IC2.13 v95.25,54.11 | v103.82,54.93 v103.82,73.66 | v97.47,73.66 IC4.13
  Bottom 0.254: v41.91,23.81 v51.75,23.81 | v51.75,36.83 v55.24,36.83 | v55.56,48.26 56.49,48.13 57.18,48.26 v66.99,48.26 | JP15.2 67.63,53.66 69.53,53.66 69.85,53.98 74.93,53.98 75.25,54.29 76.2,54.29 76.52,53.98 v95.25,54.11 96.49,54.41 102.84,54.44 v103.82,54.93 | v103.82,73.66 v97.47,73.66
INT1TX1  (via drill 0.51)
  Top 0.254: U2.30 v29.59,44.58 | v52.23,34.29 52.55,34.92 52.55,39.21 52.23,40.16 52.23,43.5 v52.7,44.45 v52.7,48.9 | v55.4,34.45 IC1.12 | v68.9,49.21 68.9,55.24 JP15.1 v68.58,59.69 | IC2.12 v96.52,58.74 96.52,64.77 96.84,66.04 v96.84,71.44 | v98.74,71.44 IC4.12 | IC11.8 v66.04,59.69
  Bottom 0.254: v29.59,44.58 33.66,44.77 38.1,44.45 v52.7,44.45 | v52.23,34.29 v55.4,34.45 | v52.7,48.9 53.34,49.21 v68.9,49.21 | v96.52,58.74 95.25,56.2 69.53,56.2 JP15.1 | v96.84,71.44 v98.74,71.44 | v66.04,59.69 v68.58,59.69
MODE  (via drill 0.51)
  Top 0.254: IC1.16 v62.23,34.92 | v82.23,33.02 v82.23,31.43 | v104.14,31.43 v104.14,10.16 | S2.3 115.57,8.89 115.57,10.16 v117.47,11.11
  Bottom 0.254: v62.23,34.92 73.66,33.34 v82.23,33.02 | v82.23,31.43 v104.14,31.43 | v104.14,10.16 110.81,10.16 113.35,8.89 116.84,8.89 v117.47,11.11
MOSI  (via drill 0.51)
  Top 0.254: IC1.1 61.59,43.18 61.59,46.35 65.41,46.35 66.04,47.31 v66.04,50.8 | v52.7,50.8 52.7,63.98 52.23,64.77 52.7,65.56 v52.7,72.39 | IC5.2 v85.7,34.1 | v84.14,33.34 v84.14,49.53
  Bottom 0.254: v52.7,50.8 63.5,50.8 64.77,51.12 v66.04,50.8 69.85,50.16 71.12,49.53 v84.14,49.53 | v52.7,72.39 39.37,72.39 J1.4 | v85.7,34.1 v84.14,33.34
MUX_IN0  (via drill 0.51)
  Top 0.254: U1.4 29.84,19.05 29.53,20.32 29.53,22.86 v30.48,25.4 | v34.77,25.4 v34.77,34.29 | 39.37,35.56 44.45,35.56 R22.1 48.9,36.83 48.9,44.13 R20.2 | 39.37,35.56 v38.73,34.29 | 39.37,35.56 R21.2
  Bottom 0.254: v30.48,25.4 v34.77,25.4 | v34.77,34.29 v38.73,34.29
MUX_OUT
  Top 0.254: U1.8 R15.1
N$1
  Top 0.254: J3.S 38.1,12.7 R15.2 JP9.1
N$2
  Top 0.254: IC2.5 93.98,45.72 C2.1
N$3
  Top 0.254: Y1.P$2 C5.2 62.23,54.29 62.23,47.62 58.42,47.62 58.28,39.91 58.42,39.69 IC1.7
N$4
  Top 0.254: IC1.8 57.78,39.37 57.78,47.62 Y1.P$1 C6.2
N$5
  Top 0.254: IC2.4 C1.2
N$6
  Top 0.254: IC2.2 C1.1
N$7  (via drill 0.51)
  Top 0.254: R16.2 v56.52,67.94 | v71.12,67.94 IC8.1
  Bottom 0.254: v56.52,67.94 58.42,66.67 69.85,66.67 v71.12,67.94
N$8
  Top 0.254: IC2.6 95.25,49.53 97.16,49.53 97.16,45.72 C2.2
N$9
  Top 0.254: C16.2 93.98,66.04 94.93,66.99 IC4.4
N$10
  Top 0.254: R10.1 81.28,69.85 81.28,79.38 J5.1
N$11
  Top 0.254: IC3.P6 R1.1 C8.2
N$12
  Top 0.254: R17.2 R18.1 R3.2
N$13
  Top 0.254: IC3.P2 20.32,28.57 C9.2
N$14  (via drill 0.51)
  Top 0.254: v49.85,39.37 49.53,36.51 R14.2 | R7.2 v42.55,39.37 R17.1
  Bottom 0.254: v42.55,39.37 v49.85,39.37
N$15
  Top 0.254: R18.2 46.99,42.86 41.91,42.86 R19.2 R20.1
N$16
  Top 0.254: LED2.C R2.2
N$17
  Top 0.254: U2.7 26.04,51.75 Y2.P$2 29.21,52.07 C14.2
N$18
  Top 0.254: J4.1 6.35,27.94 SJ1.1
N$19
  Top 0.254: U2.8 25.08,51.75 Y2.P$1 21.59,52.07 21.91,53.02 C15.1
N$21  (via drill 0.51)
  Top 0.254: R24.1 v12.7,17.14 J4.2 R25.2
N$22  (via drill 0.51)
  Top 0.254: IC5.5 v87.63,34.29 | v82.23,34.92 v82.23,45.09 | v78.11,45.09 LED3.C
  Bottom 0.254: v87.63,34.29 86.36,34.92 v82.23,34.92 | v82.23,45.09 v78.11,45.09
N$23  (via drill 0.51)
  Top 0.254: LED13.C v71.75,16.51 | v99.06,17.78 v99.06,20.95 | v89.22,20.95 89.22,29.21 88.58,30.16 88.58,31.11 IC5.6
  Bottom 0.254: v71.75,16.51 81.92,16.51 82.55,15.88 83.19,16.51 97.79,16.51 v99.06,17.78 | v99.06,20.95 v89.22,20.95
N$24  (via drill 0.51)
  Top 0.254: LED14.C 69.85,15.24 v71.12,15.24 | IC5.7 89.22,30.48 89.22,30.16 90.17,28.57 v90.17,21.91 | v100.33,21.91 100.33,15.19 v99.06,14.92
  Bottom 0.254: v71.12,15.24 74.3,15.24 76.83,14.92 v99.06,14.92 | v90.17,21.91 v100.33,21.91
N$25
  Top 0.254: IC5.8 89.85,30.16 90.81,28.57 92.71,26.67 92.71,17.78 LED15.C
N$26
  Top 0.254: C16.1 91.09,65.89 91.72,66.53 IC4.2
N$27
  Top 0.254: C17.1 96.2,66.04 IC4.5
N$28
  Top 0.254: C17.2 97.47,66.04 IC4.6
N$29
  Top 0.254: LED16.C 93.98,13.97 93.98,26.67 91.44,28.89 90.49,30.16 IC5.9
N$30  (via drill 0.51)
  Top 0.254: IC5.10 91.12,30.48 v91.76,29.84 | LED17.C v113.03,28.57
  Bottom 0.254: v113.03,28.57 111.76,29.84 107.31,29.84 106.68,30.48 106.05,29.84 v91.76,29.84
N$31  (via drill 0.51)
  Top 0.254: IC5.11 91.88,30.74 94.3,28.57 v93.98,27.94 | v105.41,27.94 109.22,27.94 LED18.C
  Bottom 0.254: v93.98,27.94 95.25,28.57 104.78,28.57 v105.41,27.94
N$32  (via drill 0.51)
  Top 0.254: IC5.12 92.39,31.11 v97.16,26.67 | v106.05,26.67 LED19.C
  Bottom 0.254: v97.16,26.67 v106.05,26.67
N$33
  Top 0.254: R23.2 16.51,20.32 R13.1 11.43,20.32 11.43,21.59 J4.3
N$35  (via drill 0.51)
  Top 0.254: IC5.15 v91.12,34.29 | LED6.C v107.95,50.16 | v100.65,48.26 v100.65,35.24
  Bottom 0.254: v91.12,34.29 91.76,35.56 99.69,35.56 v100.65,35.24 | v107.95,50.16 106.36,48.26 v100.65,48.26
N$36  (via drill 0.51)
  Top 0.254: IC5.16 v90.49,39.69 | v105.41,38.1 106.05,39.37 106.05,48.9 v105.73,49.21 | LED7.C v110.49,50.16
  Bottom 0.254: v90.49,39.69 90.49,38.1 v105.41,38.1 | v105.73,49.21 107.31,51.12 109.22,51.12 109.86,50.8 v110.49,50.16
N$37  (via drill 0.51)
  Top 0.254: IC5.17 v89.85,34.29 | v103.19,36.2 103.19,46.35 v102.87,47.31 | v113.03,50.16 LED8.C
  Bottom 0.254: v89.85,34.29 90.49,36.2 v103.19,36.2 | v102.87,47.31 103.5,47.62 112.08,47.62 v113.03,50.16
N$39  (via drill 0.51)
  Top 0.254: IC5.19 v88.76,34.29 | v99.69,37.15 v99.69,59.69 | v87.63,59.69 LED10.C
  Bottom 0.254: v88.76,34.29 89.22,36.83 99.06,36.83 v99.69,37.15 | v99.69,59.69 v87.63,59.69
N$40  (via drill 0.51)
  Top 0.254: IC5.20 v87.95,39.05 | v81.28,39.05 v81.28,50.8 | v74.93,50.8 74.93,72.39 73.66,74.3 73.03,76.2 v74.93,78.74 | v71.75,78.74 70.48,78.42 LED11.C
  Bottom 0.254: v87.95,39.05 v81.28,39.05 | v81.28,50.8 v74.93,50.8 | v74.93,78.74 v71.75,78.74
N$41
  Top 0.254: IC5.23 86.04,38.42 86.68,39.37 R11.1
PR8210_TIP
  Top 0.254: R9.1 75.56,69.22 75.56,74.3 J5.2
PR8210A_R_I!E  (via drill 0.51)
  Top 0.254: IC7.P$2 50.8,13.97 v53.66,13.97 | v72.39,13.81 X2.9
  Bottom 0.254: v53.66,13.97 57.78,13.97 59.69,15.56 60.64,16.19 63.5,16.19 66.04,13.97 v72.39,13.81
RX  (via drill 0.51)
  Top 0.254: IC1.9 57.15,38.73 57.15,47.94 56.52,49.21 56.52,58.42 v56.83,60.96 | JP8.3 15.24,63.5 14.92,59.69 IC9.3
  Bottom 0.254: v56.83,60.96 25.4,60.96 JP8.3
RX3V3
  Top 0.254: IC9.5 10.16,58.42 7.62,60.96 7.62,67.31 JP7.10
S2  (via drill 0.51)
  Top 0.254: IC2.14 v93.98,54.93 | v100.97,55.56 100.97,64.77 100.65,66.04 v100.65,72.39 | v94.93,72.39 IC4.15 | v115.57,62.87 v115.57,68.58
  Bottom 0.254: v93.98,54.93 100.33,54.93 v100.97,55.56 | v94.93,72.39 v100.65,72.39 102.87,71.12 113.03,71.12 v115.57,68.58 | X1.P2 118.11,62.87 116.83,63.08 v115.57,62.87
S3  (via drill 0.51)
  Top 0.254: IC2.15 v92.71,52.07 | v102.87,52.07 v102.87,58.74 v102.87,74.93 | v96.2,74.93 IC4.14
  Bottom 0.254: v92.71,52.07 v102.87,52.07 | v102.87,74.93 v96.2,74.93 | X1.P3 117.47,58.74 v102.87,58.74
S4  (via drill 0.51)
  Top 0.254: IC2.9 99.06,49.21 v98.74,49.53 | v100.65,49.53 100.33,50.16 100.33,54.93 100.15,55.56 100.33,56.2 100.33,59.05 100.52,59.69 100.33,60.33 100.33,63.5 100.01,64.45 IC4.8 v99.69,69.85 | v107.63,55.88 v107.63,69.85
  Bottom 0.254: v98.74,49.53 v100.65,49.53 | X1.P4 118.11,55.88 v107.63,55.88 | v107.63,69.85 v99.69,69.85
S5  (via drill 0.51)
  Top 0.254: IC2.8 v97.79,50.16 | v105.73,50.48 v105.73,53.02 v105.73,66.04 | v101.49,66.04 IC4.9
  Bottom 0.254: v97.79,50.16 98.11,50.48 v105.73,50.48 | v105.73,66.04 v101.49,66.04 | X1.P5 117.59,53.07 113.02,53.23 107.95,53.34 v105.73,53.02
SCK  (via drill 0.51)
  Top 0.254: IC1.3 60.01,42.55 v60.01,44.77 | v50.73,45.21 50.8,64.14 51.28,64.77 50.8,65.41 v50.8,77.47 | IC5.3 v86.68,30.16 | v83.19,30.16 v83.19,44.13
  Bottom 0.254: v50.73,45.21 51.72,44.9 52.69,45.25 v60.01,44.77 62.23,44.77 71.75,44.45 73.03,44.13 v83.19,44.13 | v50.8,77.47 39.37,77.47 J1.3 | v86.68,30.16 v83.19,30.16
SSR  (via drill 0.51)
  Top 0.254: IC1.26 71.45,25.94 | IC1.26 v71.41,25.82 | v74.93,31.75 v74.93,41.91 | v71.12,41.91 v71.12,57.47 v71.12,60.8 v71.21,64.93 | IC10.P$6 41.27,31.75 v41.9,31.35 | IC1.26 65.48,31.22 v64.31,31.92 | v57.78,59.05 57.78,62.87 R16.1 | IC11.10 66.67,62.23 67.31,60.96 v67.15,60.8 | IC11.13 66.67,64.14 v67.31,64.93
  Bottom 0.254: v57.78,59.05 61.28,58.1 68.74,58.1 70.33,57.47 v71.12,57.47 | v71.41,25.82 72.39,27.3 73.03,29.53 v74.93,31.75 | v74.93,41.91 v71.12,41.91 | v41.9,31.35 54.61,31.11 55.25,30.9 57.1,30.9 57.78,31.11 63.4,31.39 v64.31,31.92 | v67.15,60.8 v71.12,60.8 | v67.31,64.93 v71.21,64.93
STAND_BY  (via drill 0.51)
  Top 0.254: U2.14 25.4,41.91 v25.72,43.81 26.35,45.4 23.81,46.99 20.64,47.31 20.32,52.07 v20.95,53.34 | v22.86,53.66 22.86,57.15 JP11.4 | X2.5 v82.55,17.14 | v36.83,19.53 35.56,20.95 35.56,36.83 v34.92,36.99
  Bottom 0.254: v20.95,53.34 v22.86,53.66 | v82.55,17.14 72.71,17.14 71.75,17.46 70.8,17.14 46.04,17.14 43.18,19.68 38.73,19.68 v36.83,19.53 | v34.92,36.99 27.94,36.83 26.04,40.01 v25.72,43.81
TCK  (via drill 0.51)
  Top 0.254: IC1.21 v60.64,27.94 | v57.15,28.26 57.15,24.13 JP5.1
  Bottom 0.254: v60.64,27.94 v57.15,28.26
TDI
  Top 0.254: IC1.24 67.31,27.3 67.31,24.13 JP5.9
TDO  (via drill 0.51)
  Top 0.254: v64.75,21.78 IC1.23
  Bottom 0.254: JP5.3 62.23,21.59 64.45,21.59 v64.75,21.78
TIED  (via drill 0.51)
  Top 0.254: X1.P20 122.03,46.88 120.65,48.26 120.65,49.6 X1.P6 | IC8.3 v67.94,68.58 | v115.89,51.12 116.2,51.44 116.2,59.05 v115.89,59.69 | v113.35,59.69 v113.35,68.9
  Bottom 0.254: X1.P6 117.06,51.02 v115.89,51.12 | v67.94,68.58 69.22,69.22 v113.35,68.9 | v115.89,59.69 v113.35,59.69
TMS
  Top 0.254: IC1.22 62.23,24.13 JP5.5
TX  (via drill 0.51)
  Top 0.254: IC1.10 56.52,38.1 56.52,48.26 55.88,49.21 v55.88,60.01 | IC9.4 15.56,59.05 16.51,63.5 v20,64.77 JP8.4
  Bottom 0.254: v55.88,60.01 55.24,60.33 24.77,60.33 v20,64.77
TX3V3
  Top 0.254: IC9.2 10.16,60.96 8.26,63.5 8.26,69.85 JP7.8
V+1
  Top 0.254: IC2.3 91.44,43.18 C3.2
V+2
  Top 0.254: C18.2 91.44,63.5 91.44,65.41 92.02,66.1 93.03,66.36 IC4.3
V-1
  Top 0.254: IC2.7 96.52,43.18 C4.1
V-2
  Top 0.254: C19.1 99.06,63.5 99.06,66.04 IC4.7
VCC  (via drill 0.51)
  Top 0.254: IC7.P$5 C23.1 | LED2.A F1.P$2 | v58.1,30.16 v58.42,27.3 | v39.37,79.38 39.37,74.93 J1.2 45.09,73.66 R8.1 R26.1 | IC5.4 87.31,33.34 86.68,34.29 85.41,35.88 IC5.24 | 73.66,45.72 LED3.A | LED10.A v82.55,71.12 82.55,69.85 83.19,68.58 83.19,66.04 Z1.2 | C3.1 88.3,44.13 85.09,44.45 | 115.57,43.18 v115.25,43.18 | v69.22,70.48 67.31,71.75 66.04,74.3 R27.2 LED11.A | v50.48,19.05 50.36,17.79 | IC10.P$5 40.96,31.11 41.91,30.48 42.86,30.8 43.5,31.73 C24.1 | Z2.2 v54.93,70.48 | IC9.13 18.1,53.66 18.26,59.21 18.26,60.64 IC9.24 | R12.2 v77.47,60.01
  Top 0.508: U1.3 C10.1 | U2.6 26.67,46.04 27.16,45.72 | 27.16,45.72 26.51,43.5 26.04,41.91 26.04,40.64 U2.18 v26.04,36.83 | U2.4 28.26,46.04 27.16,45.72 | IC9.24 v20.32,61.91
  Top 0.61: LED16.A LED15.A v90.17,19.05 | LED14.A LED13.A v65.72,19.05 | LED6.A LED7.A LED8.A v113.03,43.18 | C10.1 31.75,25.4 v31.75,33.02 29.21,33.02 | C23.1 50.36,17.79 50.48,27.94 IC6.20 v45.77,29.2 45.77,29.22 45.72,32.07 C24.1 | v58.1,30.16 IC1.17 60.33,32.38 v62.55,32.38 | IC1.27 65.72,32.38 v64.45,33.06 v64.45,37.78 66.99,37.78 IC1.38 69.85,40.64 73.66,40.64 73.66,45.72 | IC1.5 v62.55,37.78 | IC5.24 85.41,39.37 85.09,40.64 | v107.95,19.05 LED19.A LED18.A LED17.A 115.57,24.13 | 115.57,24.13 115.57,33.34 114.94,34.29 115.57,35.24 115.57,43.18 | 115.57,24.13 v115.57,18.1 | C26.1 43.5,31.73 | IC11.14 66.67,66.04 68.2,66.8 | 68.2,66.8 69.22,67.31 v69.22,70.48 | 92.39,79.06 IR1.2 | v106.05,80.01 JP16.1 | C25.1 68.2,66.8
  Top 1.016: C27.1 IC3.P8 | C27.1 29.21,33.02 v29.21,31.75 | C27.1 27.3,36.51 | 27.3,36.51 v26.04,36.83 | C13.1 27.3,36.51 | F1.P$2 25.4,73.66 26.35,76.2 C11.1 | v51.75,29.84 C7.1 50.48,27.94 | v73.66,70.48 v73.66,60.01 v73.66,48.26 73.66,45.72 | C20.2 92.39,79.06 IC4.17 v92.39,71.12 | C18.1 C12.2 IC2.17 90.17,49.53 86.36,49.53 v85.09,48.26 85.09,44.45 85.09,40.64 C21.1 | C22.1 v20.32,61.91
  Bottom 0.254: J8.2 15.24,36.83 19.05,36.83 21.59,37.15 v26.04,36.83 | C11.1 34.29,80.01 v39.37,79.38 | v58.42,27.3 JP5.4 | v77.47,60.01 v73.66,60.01
  Bottom 0.61: v31.75,33.02 34.92,33.02 34.92,30.48 41.59,29.84 41.91,29.21 v45.77,29.2 | v107.95,19.05 v90.17,19.05 v65.72,19.05 v50.48,19.05 | v62.55,32.38 v64.45,33.06 | v62.55,37.78 v64.45,37.78 | v115.25,43.18 v113.03,43.18 | v115.57,18.1 116.97,17.78 JP17.1 | v106.05,80.01 105.41,80.64 99.69,80.64 96.52,79.38 IR1.2
  Bottom 0.762: v51.75,29.84 v58.1,30.16
  Bottom 1.016: 12.7,61.91 12.7,62.23 15.24,64.14 JP8.2 17.46,69.53 F1.P$2 v54.93,70.48 60.96,67.94 62.87,67.94 v69.22,70.48 v73.66,70.48 77.47,70.48 v82.55,71.12 v92.39,71.12 | 12.7,61.91 11.43,44.45 11.43,31.75 v29.21,31.75 | v20.32,61.91 12.7,61.91 | v73.66,48.26 v85.09,48.26
VID_IN  (via drill 0.51)
  Top 0.254: v19.05,24.77 C9.1 JP10.1 R6.1 | U1.5 29.21,13.97 v27.3,24.77 | v12.06,26.67 SJ1.2
  Bottom 0.254: VID_IN.P2 v12.06,26.67 JP10.1 | v27.3,24.77 v19.05,24.77
VSYNC
  Top 0.254: IC3.P3 23.5,27.3 24.13,26.67 24.13,25.4 22.23,24.77 22.23,22.86 JP13.1

## Text on the board
tPlace: DIAGNOSE | 5V ONLY! | IR Rcvr | 1 | * - Mode not / supported at / release | MAIN | 5V | GND | PR-8210 | 5V/GND | POWER | RESET | 5V | RX | TX | !RST | GND | DIAG | R1 | T1 | Dexter rev 3g | laserdisc-replacement.com | LDP-1450 | VIP9500SG | Other | 3 Oct 2017 | Pulse | DO NOT PLUG IN BACKWARD | To Pi | AUX | VP-931 | VP-932* | Simutrek* | V | C | F | A/V IN | L | G | R | 5V | LD-V1000 | PR-7820 | VIDEO OUT | Badlands | PR-8210A | LEFT | RIGHT | GND | AUDIO / / / OUT | MODE